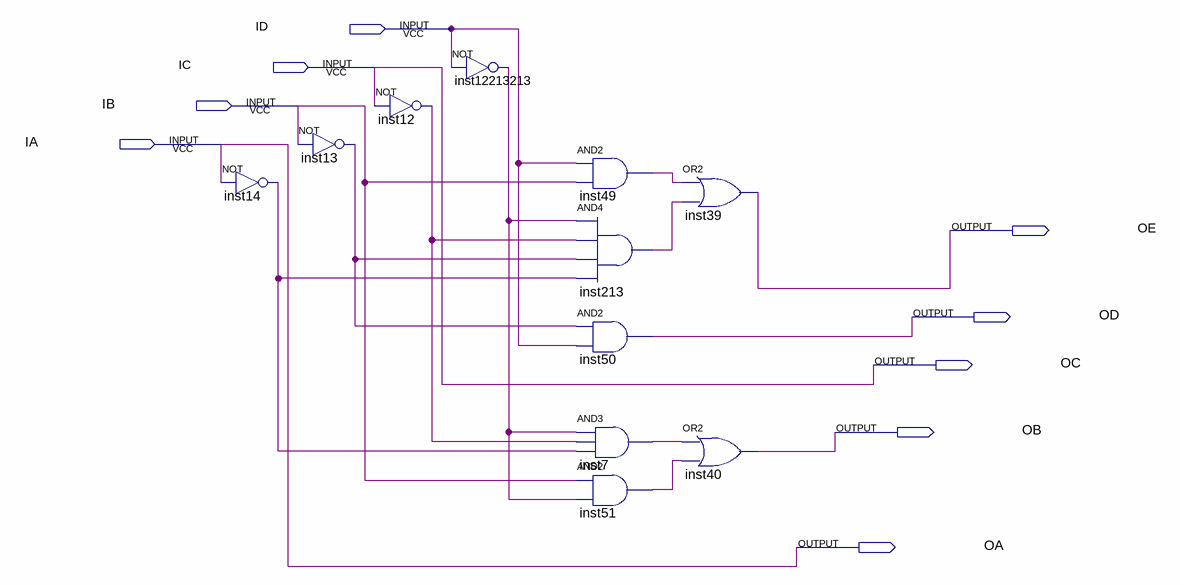
[diagram p0: schematic sheet]
// Quartus schematic decorder_12_hours.bdf as structural Verilog: 11 symbols, 9 pins
module decorder_12_hours (
  input  ID,
  input  IC,
  input  IB,
  input  IA,
  output OE,
  output OD,
  output OC,
  output OB,
  output OA
);

  wire inst7_out, inst12_out, inst13_out, inst14_out, inst49_out, inst51_out, inst213_out, inst12213213_out;

  not inst14 (inst14_out, IA);
  not inst13 (inst13_out, IB);
  not inst12 (inst12_out, IC);
  not inst12213213 (inst12213213_out, ID);
  and inst49 (inst49_out, ID, IB);
  and inst213 (inst213_out, inst12213213_out, inst12_out, inst13_out, inst14_out);
  and inst50 (OD, inst13_out, ID);
  and inst7 (inst7_out, inst12213213_out, inst12_out, inst14_out);
  and inst51 (inst51_out, IB, inst12213213_out);
  or inst39 (OE, inst49_out, inst213_out);
  or inst40 (OB, inst7_out, inst51_out);

  assign OA = IA;
  assign OC = IC;
endmodule
